# Altium project PCB_Project1.PrjPCB
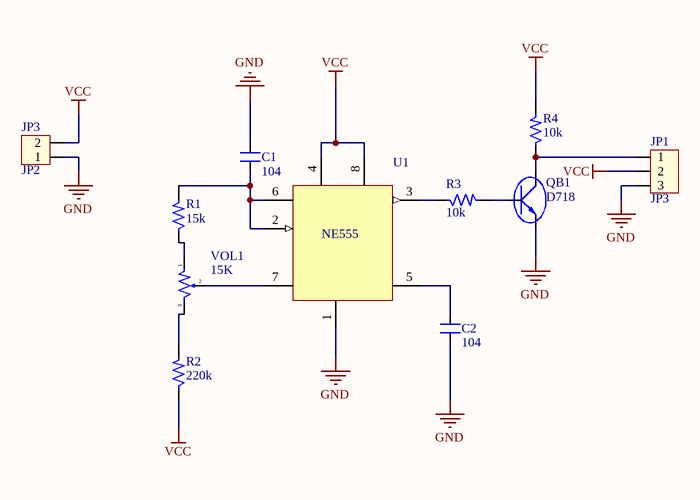
[diagram p0: MACH TAO XUNG.SchDoc]
1 sheet, 11 parts. Net scope: global (net labels, ports and power ports of the same name join across sheets).
Board file: PCB1.PcbDoc

## Sheet MACH TAO XUNG.SchDoc
size A4

### Parts
C1  104  [SM-0805]
C2  104  [SM-0805]
JP1  JP3  [CON3]
JP3  JP2  [CON2]
QB1  D718  [QTO-247]
R1  15k  [SM-0805]
R2  220k  [SM-0805]
R3  10k  [SM-0805]
R4  10k  [SM-0805]
U1  NE555  [DIP8/W0.3K]
VOL1  15K  [VOL_1]

### Nets
GND: C1.2 C2.1 JP1.3 JP3.1 QB1.3(E) U1.1
VCC: JP1.2 JP3.2 R2.1 R4.2 U1.4 U1.8
NetC1_1: C1.1 R1.2 U1.2 U1.6
NetC2_2: C2.2 U1.5
NetJP1_1: JP1.1 QB1.2(C) R4.1
NetQB1_1: QB1.1(B) R3.2
NetR1_1: R1.1 VOL1.1
NetR2_2: R2.2 VOL1.3
NetR3_1: R3.1 U1.3
NetU1_7: U1.7 VOL1.2

### Library data of the parts
C1 C2 = CM: Cap SMD; Value: 103
JP1 = Con3: Connector 3; Value: Connector 3
JP3 = Con2: Connector 2; Value: Connector 2
QB1 = D718: Transistor Power Supply; Value: D718
R1-R4 = R: Resistor 1/4W; Value: R1/4W - 1K
VOL1 = VOL-S: Var Resistor; Value: Volume 50k